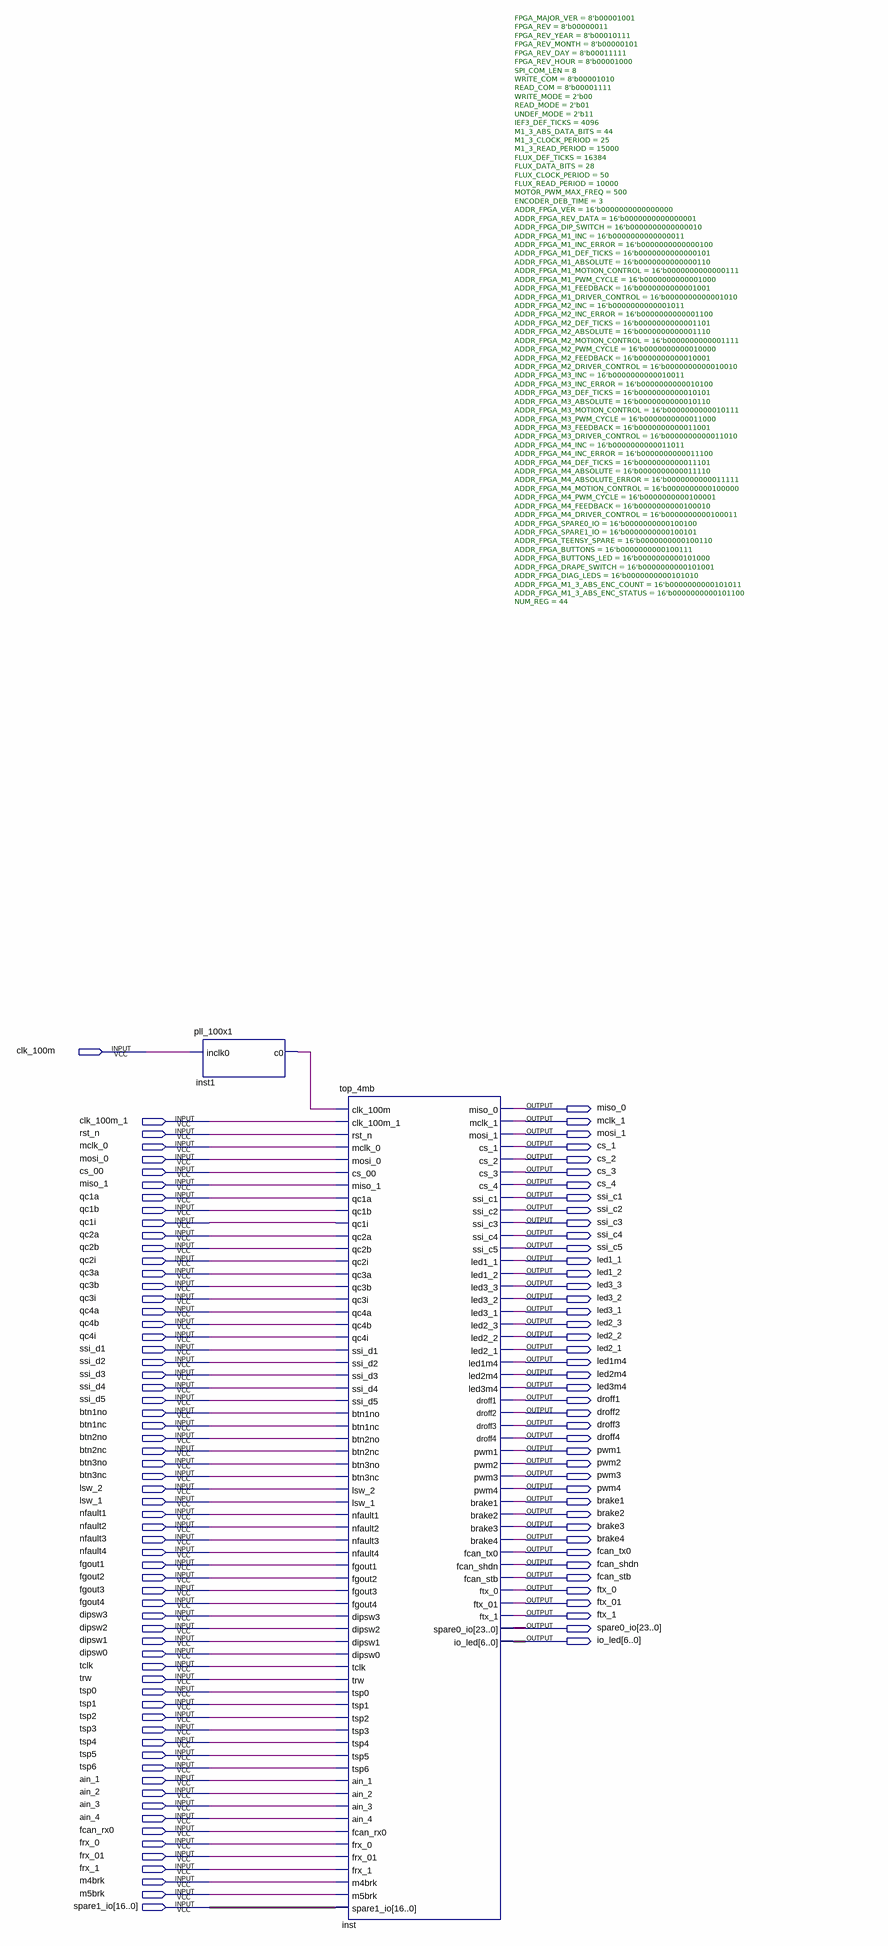
[diagram p0: schematic sheet]
// Quartus schematic fpga_4mb.bdf as structural Verilog: 2 symbols, 107 pins
module fpga_4mb (
  input  clk_100m,
  input  clk_100m_1,
  input  rst_n,
  input  mclk_0,
  input  mosi_0,
  input  cs_00,
  input  miso_1,
  input  qc1a,
  input  qc1b,
  input  qc1i,
  input  qc2a,
  input  qc2b,
  input  qc2i,
  input  qc3a,
  input  qc3b,
  input  qc3i,
  input  qc4a,
  input  qc4b,
  input  qc4i,
  input  ssi_d1,
  input  ssi_d2,
  input  ssi_d3,
  input  ssi_d4,
  input  ssi_d5,
  input  btn1no,
  input  btn1nc,
  input  btn2no,
  input  btn2nc,
  input  btn3no,
  input  btn3nc,
  input  lsw_2,
  input  lsw_1,
  input  nfault1,
  input  nfault2,
  input  nfault3,
  input  nfault4,
  input  fgout1,
  input  fgout2,
  input  fgout3,
  input  fgout4,
  input  dipsw3,
  input  dipsw2,
  input  dipsw1,
  input  dipsw0,
  input  tclk,
  input  trw,
  input  tsp0,
  input  tsp1,
  input  tsp2,
  input  tsp3,
  input  tsp4,
  input  tsp5,
  input  tsp6,
  input  ain_1,
  input  ain_2,
  input  ain_3,
  input  ain_4,
  input  fcan_rx0,
  input  frx_0,
  input  frx_01,
  input  frx_1,
  input  m4brk,
  input  m5brk,
  input  [16:0] spare1_io,
  output miso_0,
  output mclk_1,
  output mosi_1,
  output cs_1,
  output cs_2,
  output cs_3,
  output cs_4,
  output ssi_c1,
  output ssi_c2,
  output ssi_c3,
  output ssi_c4,
  output ssi_c5,
  output led1_1,
  output led1_2,
  output led3_3,
  output led3_2,
  output led3_1,
  output led2_3,
  output led2_2,
  output led2_1,
  output led1m4,
  output led2m4,
  output led3m4,
  output droff1,
  output droff2,
  output droff3,
  output droff4,
  output pwm1,
  output pwm2,
  output pwm3,
  output pwm4,
  output brake1,
  output brake2,
  output brake3,
  output brake4,
  output fcan_tx0,
  output fcan_shdn,
  output fcan_stb,
  output ftx_0,
  output ftx_01,
  output ftx_1,
  output [23:0] spare0_io,
  output [6:0] io_led
);

  wire inst1_c0;

  pll_100x1 inst1 (.inclk0(clk_100m), .c0(inst1_c0));
  top_4mb #(.FPGA_MAJOR_VER(8'b00001001), .FPGA_REV(8'b00000011), .FPGA_REV_YEAR(8'b00010111), .FPGA_REV_MONTH(8'b00000101), .FPGA_REV_DAY(8'b00011111), .FPGA_REV_HOUR(8'b00001000), .SPI_COM_LEN(8), .WRITE_COM(8'b00001010), .READ_COM(8'b00001111), .WRITE_MODE(2'b00), .READ_MODE(2'b01), .UNDEF_MODE(2'b11), .IEF3_DEF_TICKS(4096), .M1_3_ABS_DATA_BITS(44), .M1_3_CLOCK_PERIOD(25), .M1_3_READ_PERIOD(15000), .FLUX_DEF_TICKS(16384), .FLUX_DATA_BITS(28), .FLUX_CLOCK_PERIOD(50), .FLUX_READ_PERIOD(10000), .MOTOR_PWM_MAX_FREQ(500), .ENCODER_DEB_TIME(3), .ADDR_FPGA_VER(16'b0000000000000000), .ADDR_FPGA_REV_DATA(16'b0000000000000001), .ADDR_FPGA_DIP_SWITCH(16'b0000000000000010), .ADDR_FPGA_M1_INC(16'b0000000000000011), .ADDR_FPGA_M1_INC_ERROR(16'b0000000000000100), .ADDR_FPGA_M1_DEF_TICKS(16'b0000000000000101), .ADDR_FPGA_M1_ABSOLUTE(16'b0000000000000110), .ADDR_FPGA_M1_MOTION_CONTROL(16'b0000000000000111), .ADDR_FPGA_M1_PWM_CYCLE(16'b0000000000001000), .ADDR_FPGA_M1_FEEDBACK(16'b0000000000001001), .ADDR_FPGA_M1_DRIVER_CONTROL(16'b0000000000001010), .ADDR_FPGA_M2_INC(16'b0000000000001011), .ADDR_FPGA_M2_INC_ERROR(16'b0000000000001100), .ADDR_FPGA_M2_DEF_TICKS(16'b0000000000001101), .ADDR_FPGA_M2_ABSOLUTE(16'b0000000000001110), .ADDR_FPGA_M2_MOTION_CONTROL(16'b0000000000001111), .ADDR_FPGA_M2_PWM_CYCLE(16'b0000000000010000), .ADDR_FPGA_M2_FEEDBACK(16'b0000000000010001), .ADDR_FPGA_M2_DRIVER_CONTROL(16'b0000000000010010), .ADDR_FPGA_M3_INC(16'b0000000000010011), .ADDR_FPGA_M3_INC_ERROR(16'b0000000000010100), .ADDR_FPGA_M3_DEF_TICKS(16'b0000000000010101), .ADDR_FPGA_M3_ABSOLUTE(16'b0000000000010110), .ADDR_FPGA_M3_MOTION_CONTROL(16'b0000000000010111), .ADDR_FPGA_M3_PWM_CYCLE(16'b0000000000011000), .ADDR_FPGA_M3_FEEDBACK(16'b0000000000011001), .ADDR_FPGA_M3_DRIVER_CONTROL(16'b0000000000011010), .ADDR_FPGA_M4_INC(16'b0000000000011011), .ADDR_FPGA_M4_INC_ERROR(16'b0000000000011100), .ADDR_FPGA_M4_DEF_TICKS(16'b0000000000011101), .ADDR_FPGA_M4_ABSOLUTE(16'b0000000000011110), .ADDR_FPGA_M4_ABSOLUTE_ERROR(16'b0000000000011111), .ADDR_FPGA_M4_MOTION_CONTROL(16'b0000000000100000), .ADDR_FPGA_M4_PWM_CYCLE(16'b0000000000100001), .ADDR_FPGA_M4_FEEDBACK(16'b0000000000100010), .ADDR_FPGA_M4_DRIVER_CONTROL(16'b0000000000100011), .ADDR_FPGA_SPARE0_IO(16'b0000000000100100), .ADDR_FPGA_SPARE1_IO(16'b0000000000100101), .ADDR_FPGA_TEENSY_SPARE(16'b0000000000100110), .ADDR_FPGA_BUTTONS(16'b0000000000100111), .ADDR_FPGA_BUTTONS_LED(16'b0000000000101000), .ADDR_FPGA_DRAPE_SWITCH(16'b0000000000101001), .ADDR_FPGA_DIAG_LEDS(16'b0000000000101010), .ADDR_FPGA_M1_3_ABS_ENC_COUNT(16'b0000000000101011), .ADDR_FPGA_M1_3_ABS_ENC_STATUS(16'b0000000000101100), .NUM_REG(44)) inst (
    .clk_100m(inst1_c0), .clk_100m_1(clk_100m_1), .rst_n(rst_n), .mclk_0(mclk_0), .mosi_0(mosi_0),
    .cs_00(cs_00), .miso_1(miso_1), .qc1a(qc1a), .qc1b(qc1b), .qc1i(qc1i), .qc2a(qc2a), .qc2b(qc2b),
    .qc2i(qc2i), .qc3a(qc3a), .qc3b(qc3b), .qc3i(qc3i), .qc4a(qc4a), .qc4b(qc4b), .qc4i(qc4i),
    .ssi_d1(ssi_d1), .ssi_d2(ssi_d2), .ssi_d3(ssi_d3), .ssi_d4(ssi_d4), .ssi_d5(ssi_d5), .btn1no(btn1no),
    .btn1nc(btn1nc), .btn2no(btn2no), .btn2nc(btn2nc), .btn3no(btn3no), .btn3nc(btn3nc), .lsw_2(lsw_2),
    .lsw_1(lsw_1), .nfault1(nfault1), .nfault2(nfault2), .nfault3(nfault3), .nfault4(nfault4),
    .fgout1(fgout1), .fgout2(fgout2), .fgout3(fgout3), .fgout4(fgout4), .dipsw3(dipsw3), .dipsw2(dipsw2),
    .dipsw1(dipsw1), .dipsw0(dipsw0), .tclk(tclk), .trw(trw), .tsp0(tsp0), .tsp1(tsp1), .tsp2(tsp2),
    .tsp3(tsp3), .tsp4(tsp4), .tsp5(tsp5), .tsp6(tsp6), .ain_1(ain_1), .ain_2(ain_2), .ain_3(ain_3),
    .ain_4(ain_4), .fcan_rx0(fcan_rx0), .frx_0(frx_0), .frx_01(frx_01), .frx_1(frx_1), .m4brk(m4brk),
    .m5brk(m5brk), .spare1_io(spare1_io), .miso_0(miso_0), .mclk_1(mclk_1), .mosi_1(mosi_1), .cs_1(cs_1),
    .cs_2(cs_2), .cs_3(cs_3), .cs_4(cs_4), .ssi_c1(ssi_c1), .ssi_c2(ssi_c2), .ssi_c3(ssi_c3),
    .ssi_c4(ssi_c4), .ssi_c5(ssi_c5), .led1_1(led1_1), .led1_2(led1_2), .led3_3(led3_3), .led3_2(led3_2),
    .led3_1(led3_1), .led2_3(led2_3), .led2_2(led2_2), .led2_1(led2_1), .led1m4(led1m4), .led2m4(led2m4),
    .led3m4(led3m4), .droff1(droff1), .droff2(droff2), .droff3(droff3), .droff4(droff4), .pwm1(pwm1),
    .pwm2(pwm2), .pwm3(pwm3), .pwm4(pwm4), .brake1(brake1), .brake2(brake2), .brake3(brake3),
    .brake4(brake4), .fcan_tx0(fcan_tx0), .fcan_shdn(fcan_shdn), .fcan_stb(fcan_stb), .ftx_0(ftx_0),
    .ftx_01(ftx_01), .ftx_1(ftx_1), .spare0_io(spare0_io), .io_led(io_led));
endmodule
